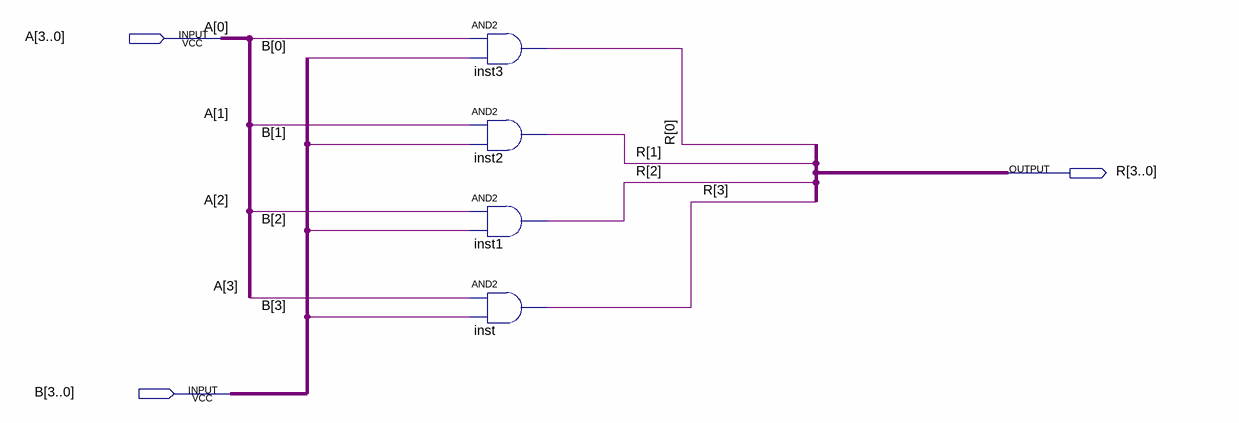
[diagram p0: schematic sheet]
// Quartus schematic And4Bit.bdf as structural Verilog: 4 symbols, 3 pins
module And4Bit (
  input  [3:0] A,
  input  [3:0] B,
  output [3:0] R
);

  and inst3 (R[0], A[0], B[0]);
  and inst2 (R[1], A[1], B[1]);
  and inst1 (R[2], A[2], B[2]);
  and inst (R[3], A[3], B[3]);
endmodule
